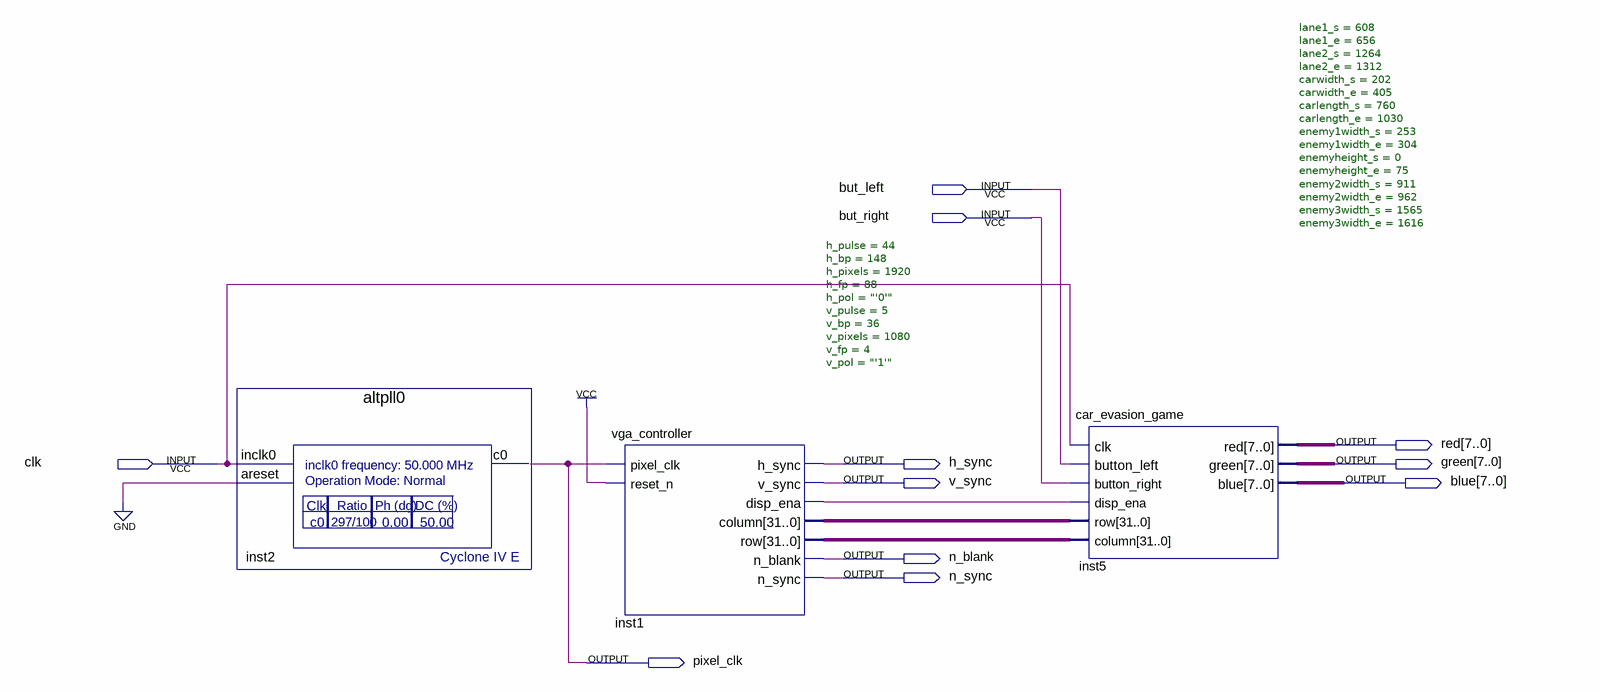
[diagram p0: schematic sheet]
// Quartus schematic ECE287_Project.bdf as structural Verilog: 3 symbols, 11 pins
module ECE287_Project (
  input  but_left,
  input  but_right,
  input  clk,
  output [7:0] red,
  output h_sync,
  output [7:0] green,
  output v_sync,
  output [7:0] blue,
  output n_blank,
  output n_sync,
  output pixel_clk
);

  wire inst1_disp_ena;
  wire [31:0] inst1_column, inst1_row;

  altpll0 inst2 (.inclk0(clk), .areset(1'b0), .c0(pixel_clk));
  vga_controller #(.h_pulse(44), .h_bp(148), .h_pixels(1920), .h_fp(88), .h_pol("'0'"), .v_pulse(5), .v_bp(36), .v_pixels(1080), .v_fp(4), .v_pol("'1'")) inst1 (
    .pixel_clk(pixel_clk), .reset_n(1'b1), .h_sync(h_sync), .v_sync(v_sync), .disp_ena(inst1_disp_ena),
    .column(inst1_column), .row(inst1_row), .n_blank(n_blank), .n_sync(n_sync));
  car_evasion_game #(.lane1_s(608), .lane1_e(656), .lane2_s(1264), .lane2_e(1312), .carwidth_s(202), .carwidth_e(405), .carlength_s(760), .carlength_e(1030), .enemy1width_s(253), .enemy1width_e(304), .enemyheight_s(0), .enemyheight_e(75), .enemy2width_s(911), .enemy2width_e(962), .enemy3width_s(1565), .enemy3width_e(1616)) inst5 (
    .clk(clk), .button_left(but_left), .button_right(but_right), .disp_ena(inst1_disp_ena),
    .row(inst1_column), .column(inst1_row), .red(red), .green(green), .blue(blue));
endmodule
